# Altium schematic sheet Joystick.SchDoc: Shipwars Joystick Schematic
size 431 x 279 mm; CheckedBy: SP, PS; Author: SP, PS; CompanyName: UPenn; DrawnBy: SP, PS; Engineer: SP, PS; Organization: UPenn; Address1: 200 S 33rd Street; Address2: Detkin Lab; Address3: Philadelphia; Address4: PA 19104; Revision: .1.0.0; SheetNumber: 8; SheetTotal: 10; Project: Shipwars
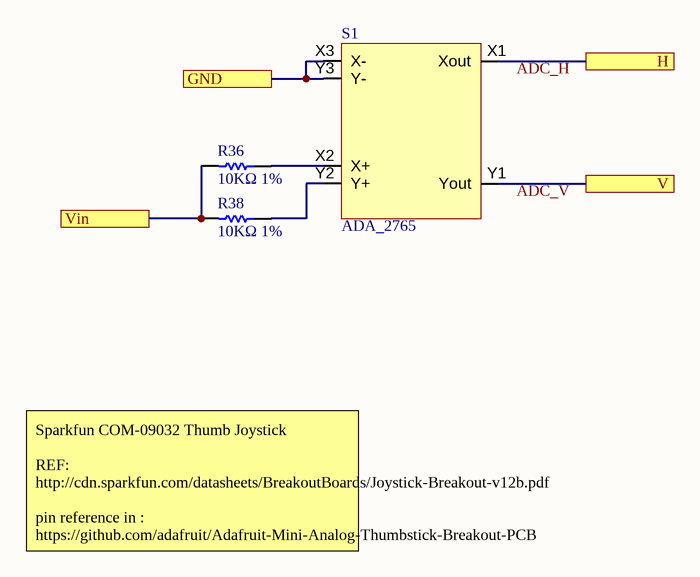
[diagram p0: Joystick.SchDoc]

## Parts
R36  10KΩ 1%  [RESC0603(1608)_N]
R38  10KΩ 1%  [RESC0603(1608)_N]
S1  ADA_2765  [ADA_2765]

## Ports
GND, H, V, Vin

## Nets
GND: S1.X3(X-) S1.Y3(Y-) ; port GND
H: S1.X1(Xout) ; port H
V: S1.Y1(Yout) ; port V
Vin: R36.2 R38.2 ; port Vin
NetR36_1: R36.1 S1.X2(X+)
NetR38_1: R38.1 S1.Y2(Y+)

## Notes on the sheet
- Sparkfun COM-09032 Thumb Joystick
  REF: http://cdn.sparkfun.com/datasheets/BreakoutBoards/Joystick-Breakout-v12b.pdf
  pin reference in : https://github.com/adafruit/Adafruit-Mini-Analog-Thumbstick-Breakout-PCB
- Labels drawn without touching a wire or pin: ADC_H, ADC_V
- DWG. NO.
- REV.
- SHT.
- THIS DOCUMENT AND THE DATA DISCLOSED HEREIN OR HEREWITH IS THE PROPERTY OF ALTIUM LIMITED AND MAY BE FREELY DISTRIBUTED IN WHOLE. NO RIGHTS ARE RESERVED OR EXPRESS OR IMPLIED WARANTEE GIVEN.
- REVISION
- DESCRIPTION
- DATE
- APPROVED
- ENG:
- APPROVALS
- PROJECT
- DSN:
- CHK:
- REFERENCE DOCUMENTS
- PROJECT REVISION:
- TITLE
- DOCUMENT REVISION:
- DESIGN ITEM:
- BOM:
- FAB DWG:
- PCB DWG:
- ASSY DWG:
- SCALE:
- SIZE
- B
- CAGE CODE
- FILE NAME
- DWG NO.
- SHEET
- OF
- REV

## Library data of the parts
R36 R38 = CMP-1012-00623-1: 10K 0.1W 1% 0603 (1608 Metric)  SMD; Value: 10000.00 Ohm; Case-EIA: 0603; Case-Metric: 1608; Power: 0.1 W; Tolerance: 1 %; Technology: SMT
S1 = ADA_2765: Mini 2-Axis Analog Thumbstick; Manufacturer: Adafruit Industries; Manufacturer Part Number: 2765; Resistance: 10kR; Supplier 1: Digi-Key; Supplier Part Number 1: 1528-1730-ND; RoHS: Yes; Stock 1: 673; Pricing 1: 1=2.50000 (USD); Mount: Through Hole; Packaging: Bulk; Length: 0.707inch; Width: 0.697inch; Height: 0.472inch; ComponentLink1URL: https://media.digikey.com/pdf/Data%20Sheets/Adafruit%20PDFs/2765_Web.pdf?src-supplier=Digi-Key; ComponentLink1Description: https://media.digikey.com/pdf/Data%20Sheets/Adafruit%20PDFs/2765_Web.pdf?src-supplier=Digi-Key